# EAGLE design KitchenLightsController V2 (EAGLE 7.4.0)
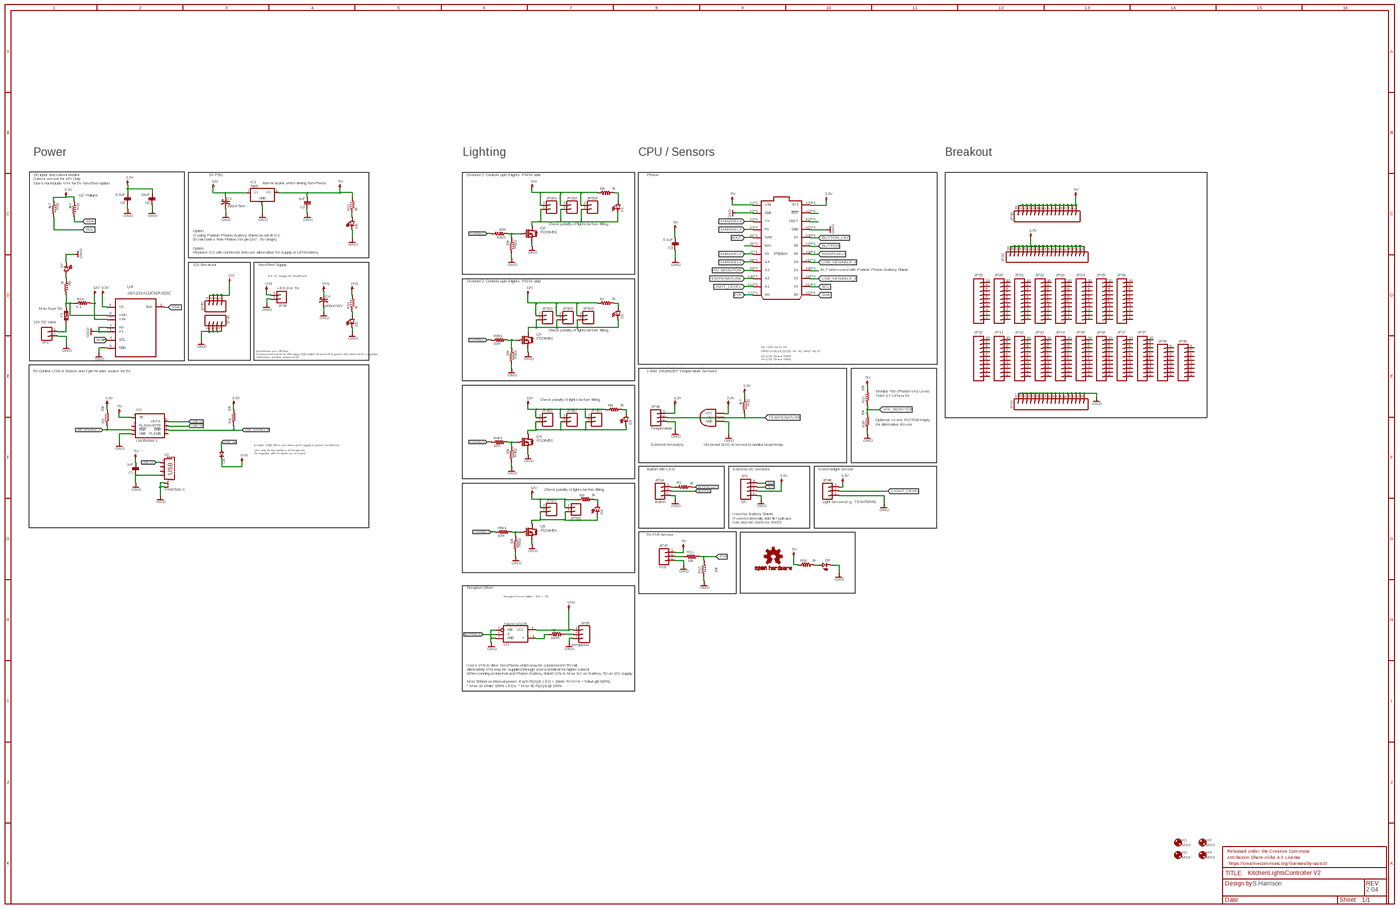
[diagram p0: schematic, sheet 1, overview]
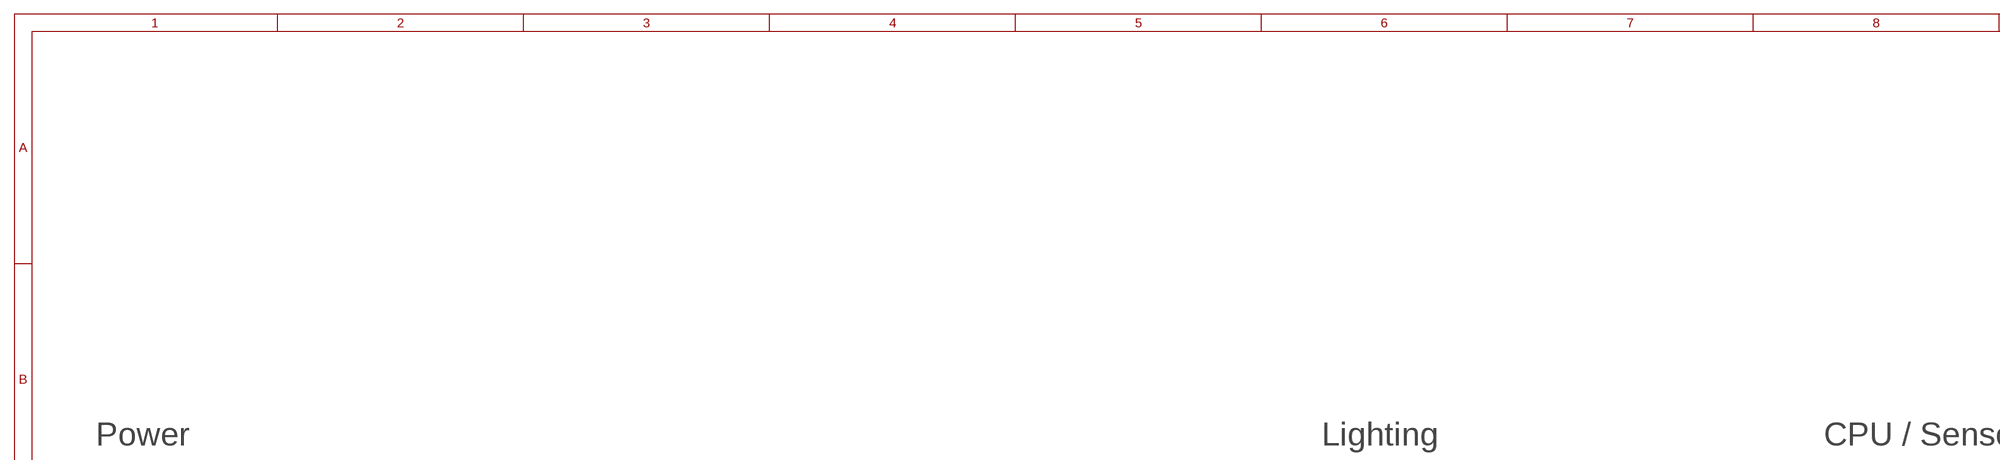
[diagram p1: schematic, sheet 1, part 1 of 4]
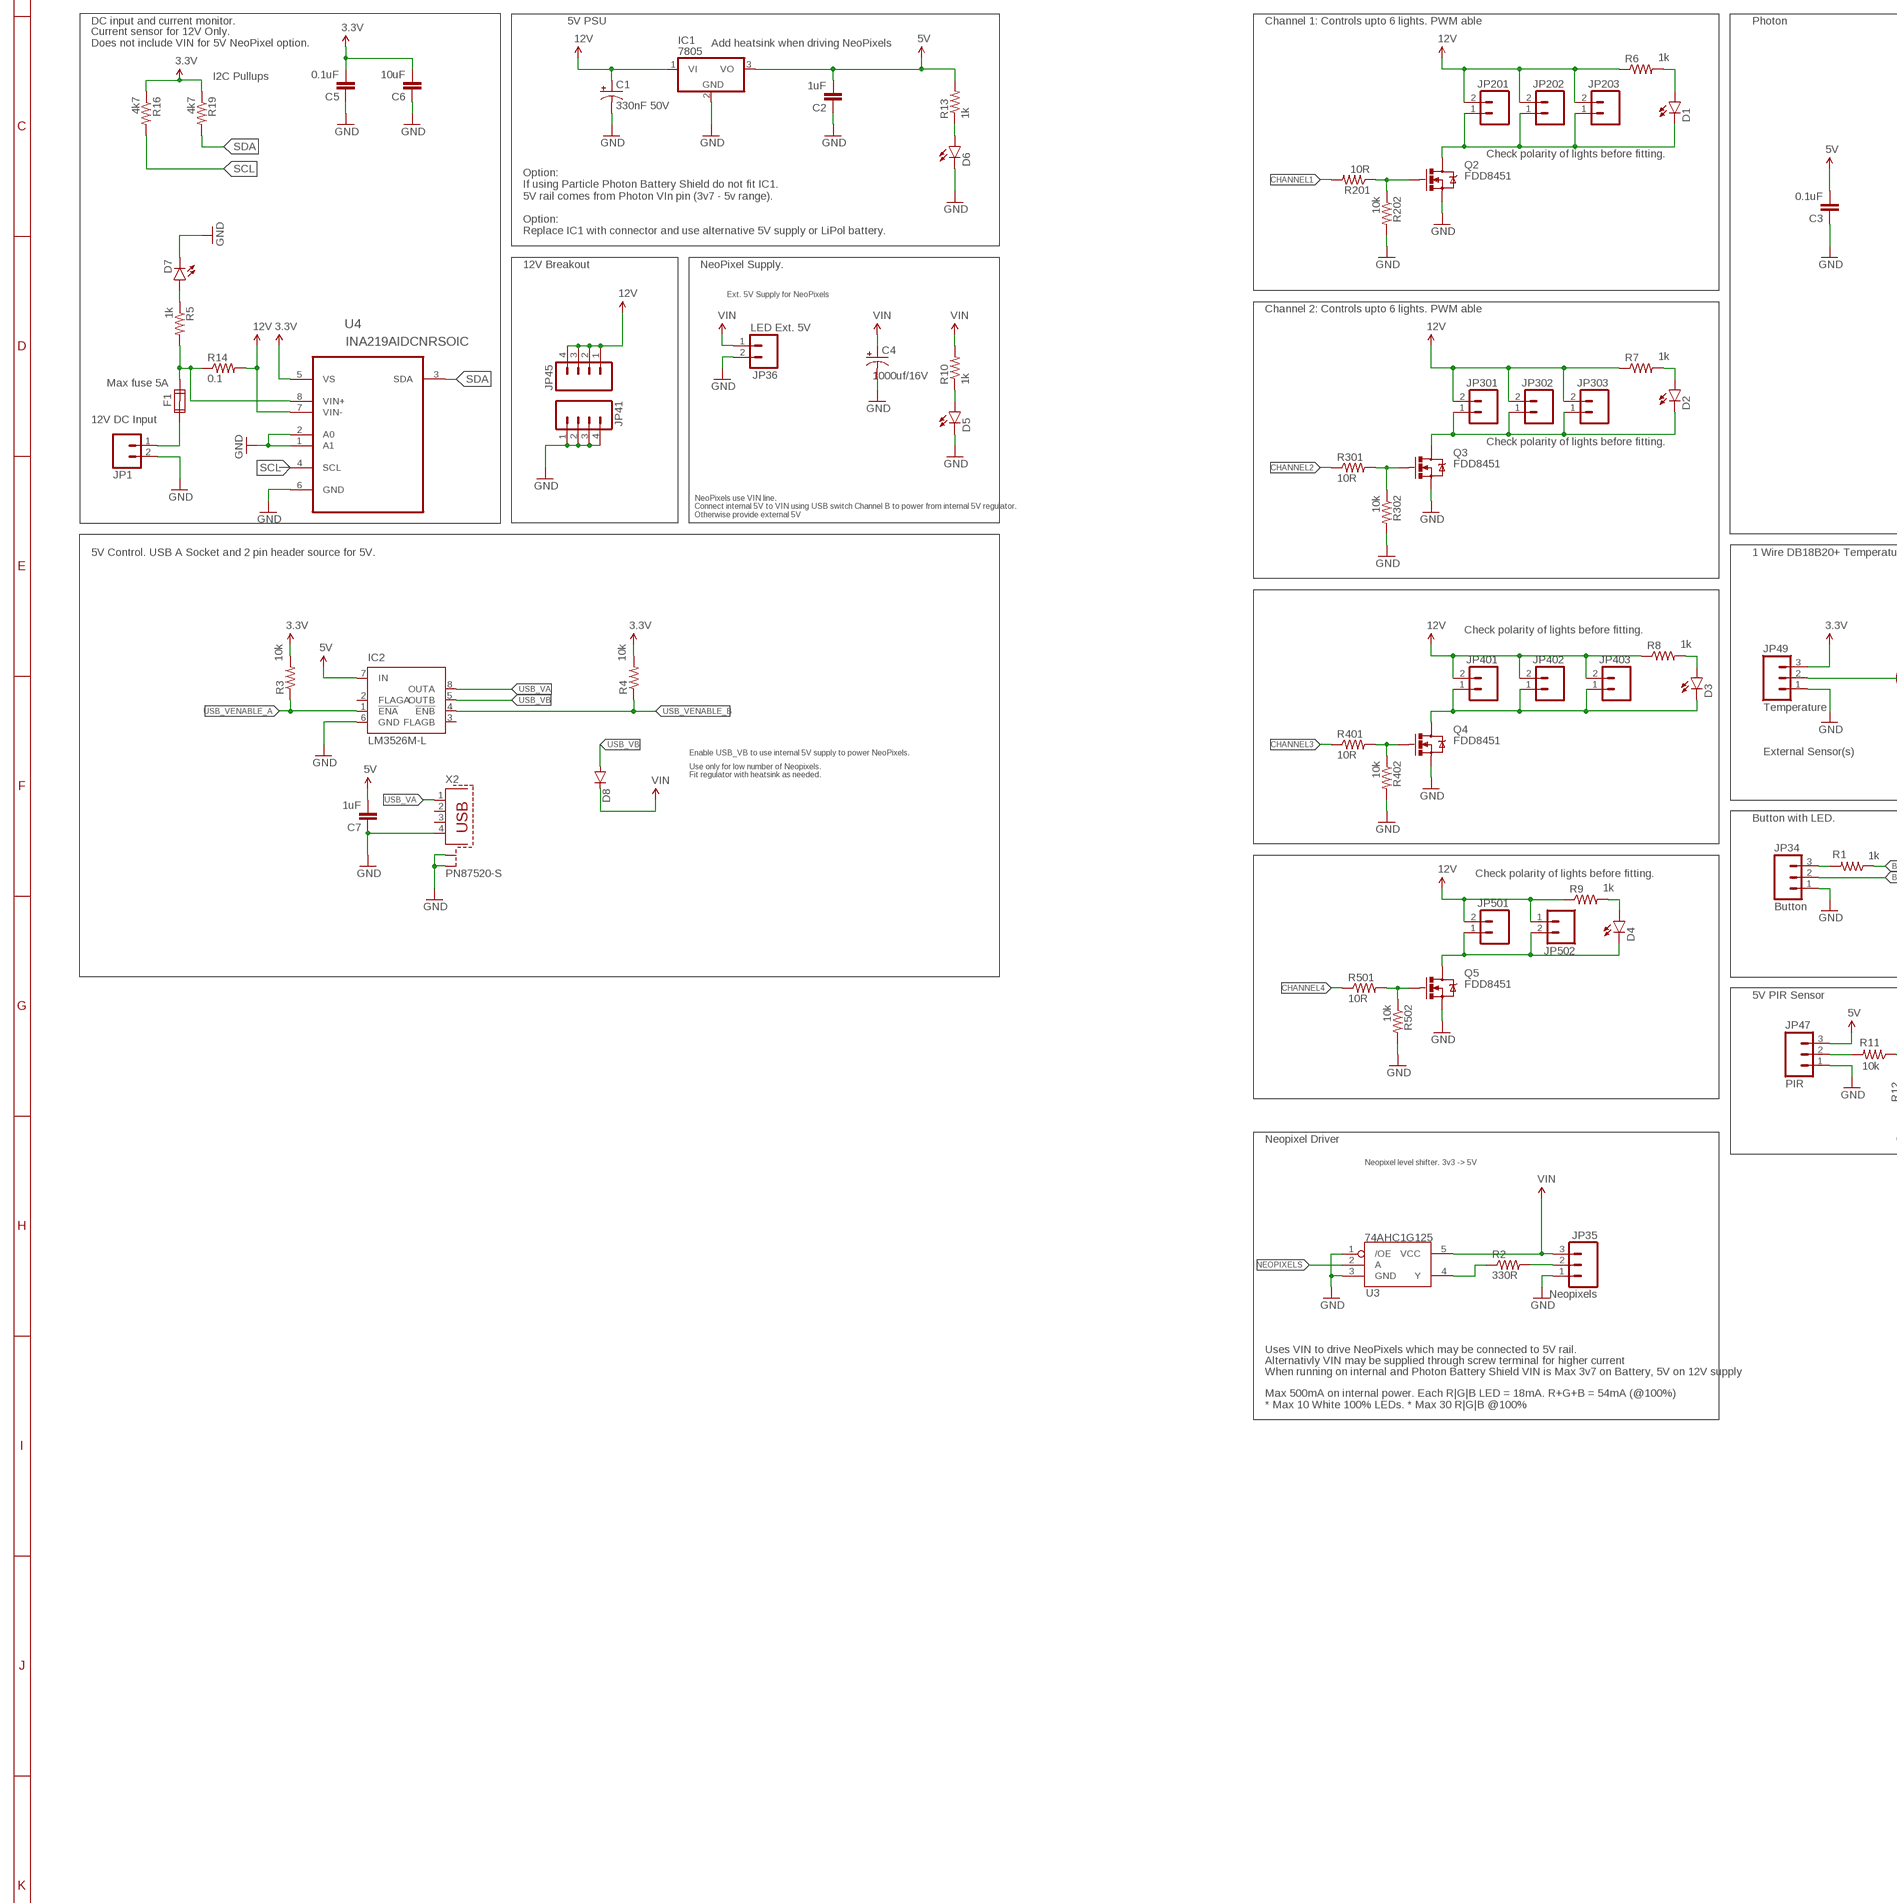
[diagram p2: schematic, sheet 1, part 2 of 4]
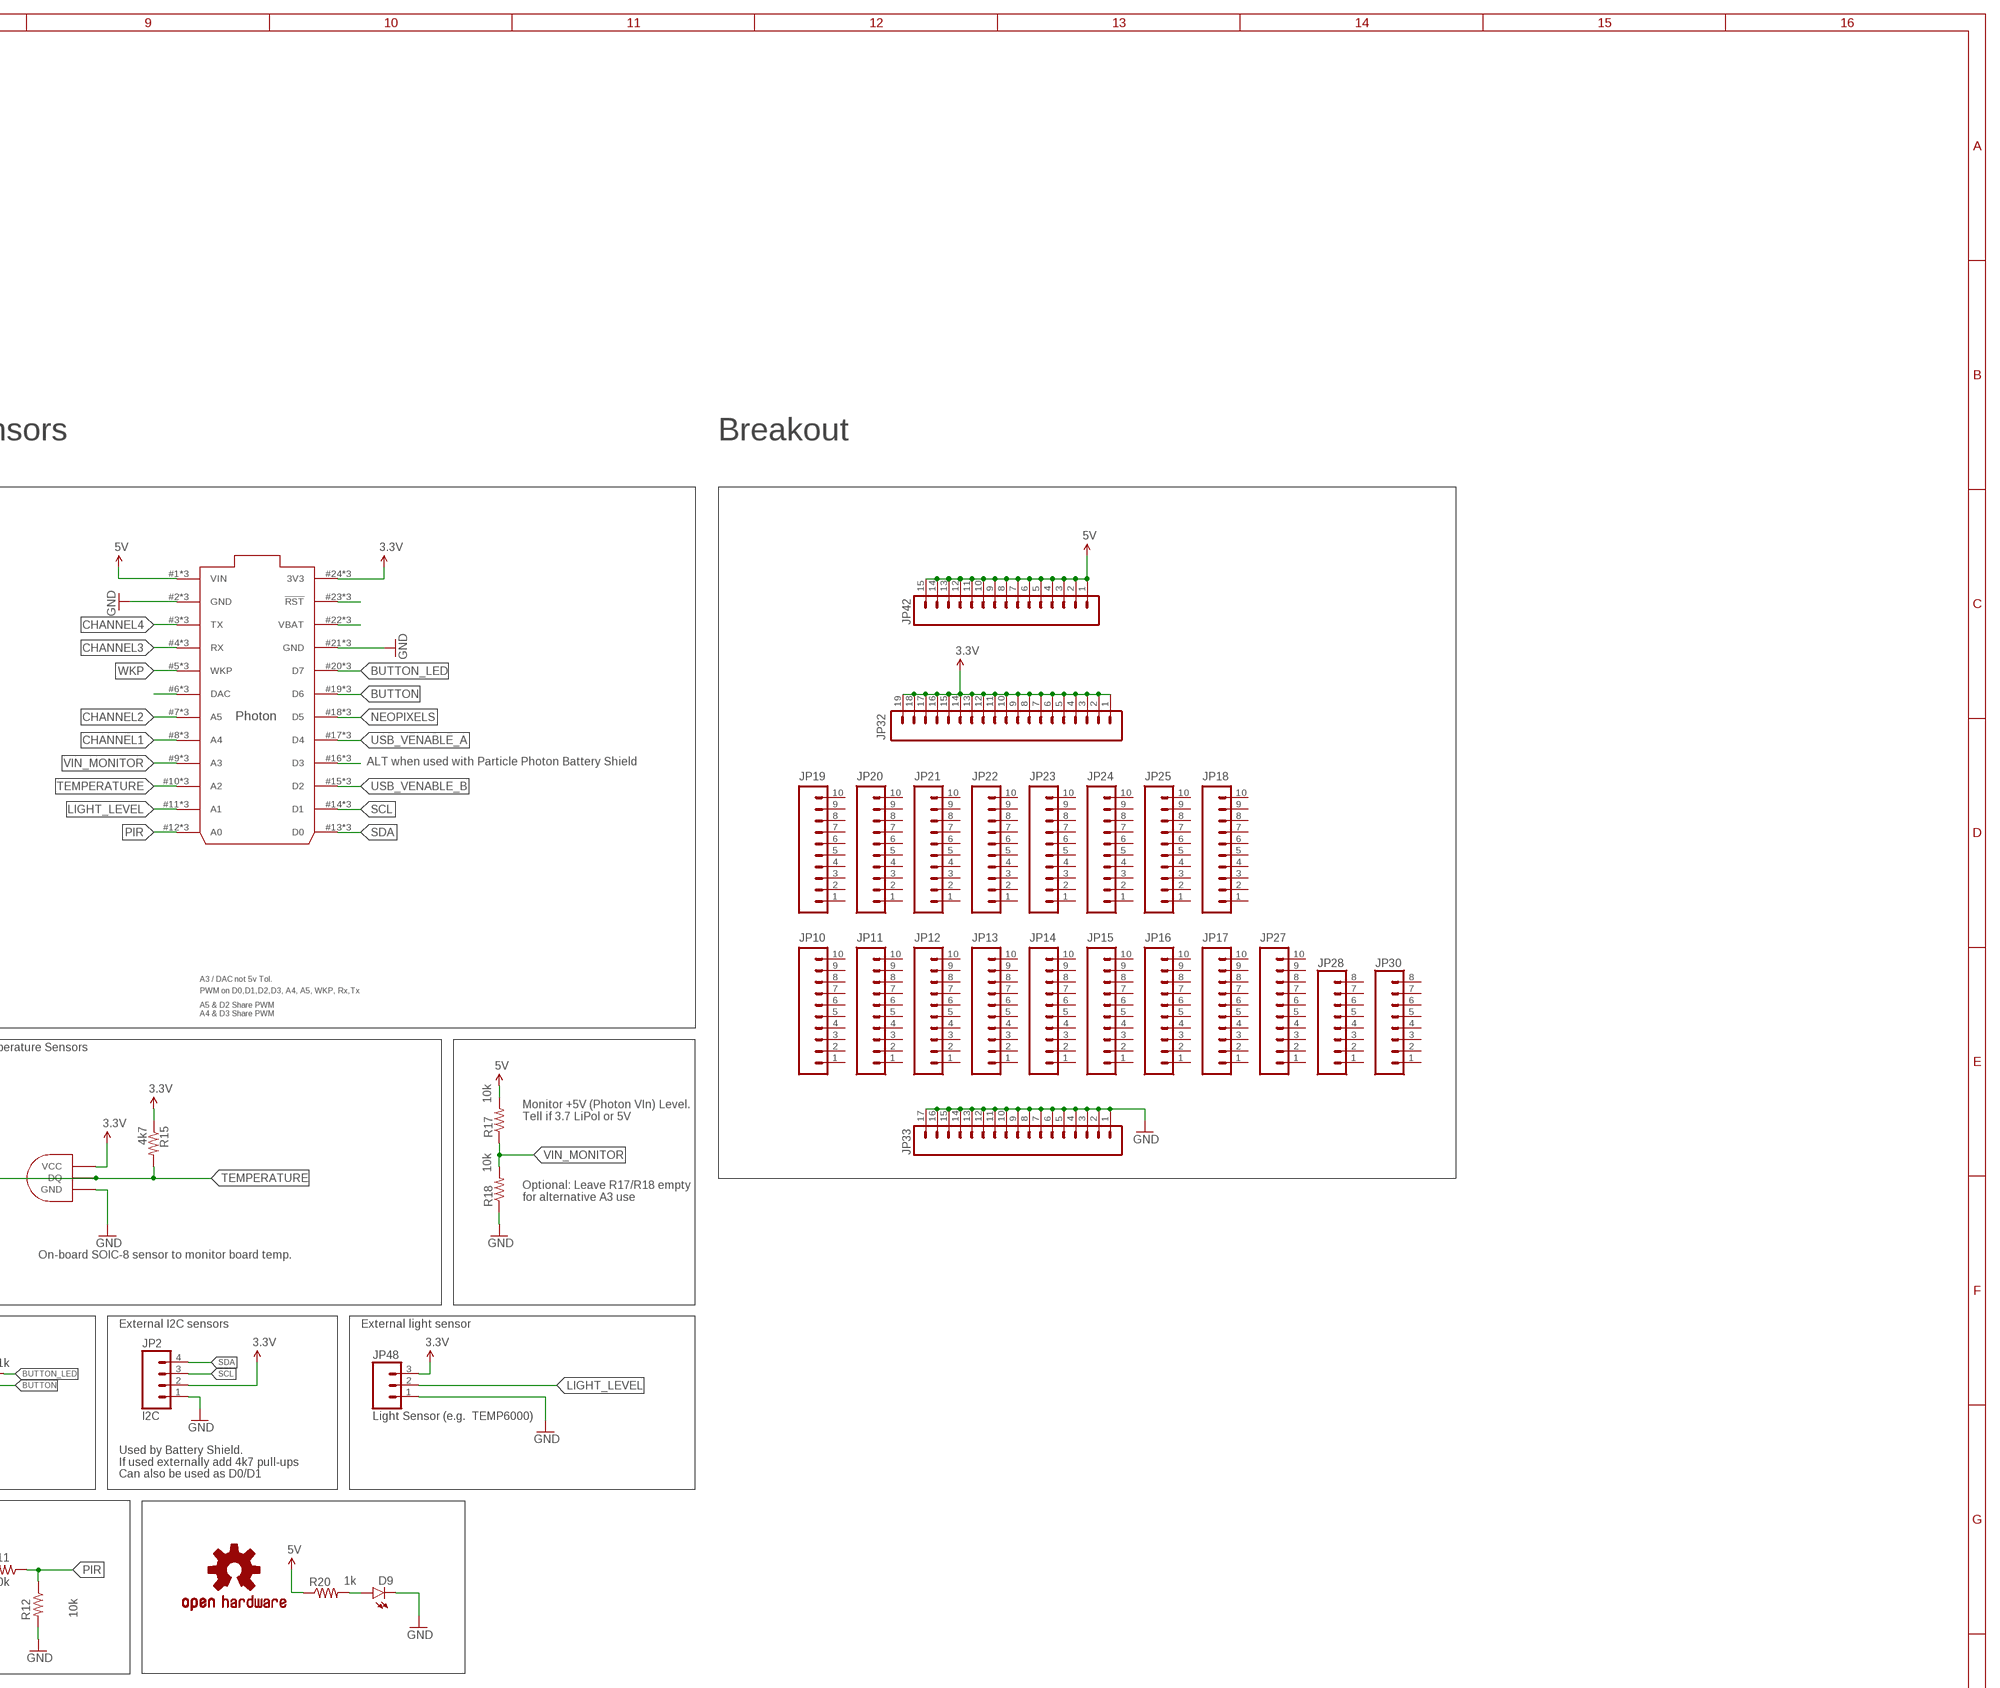
[diagram p3: schematic, sheet 1, part 3 of 4]
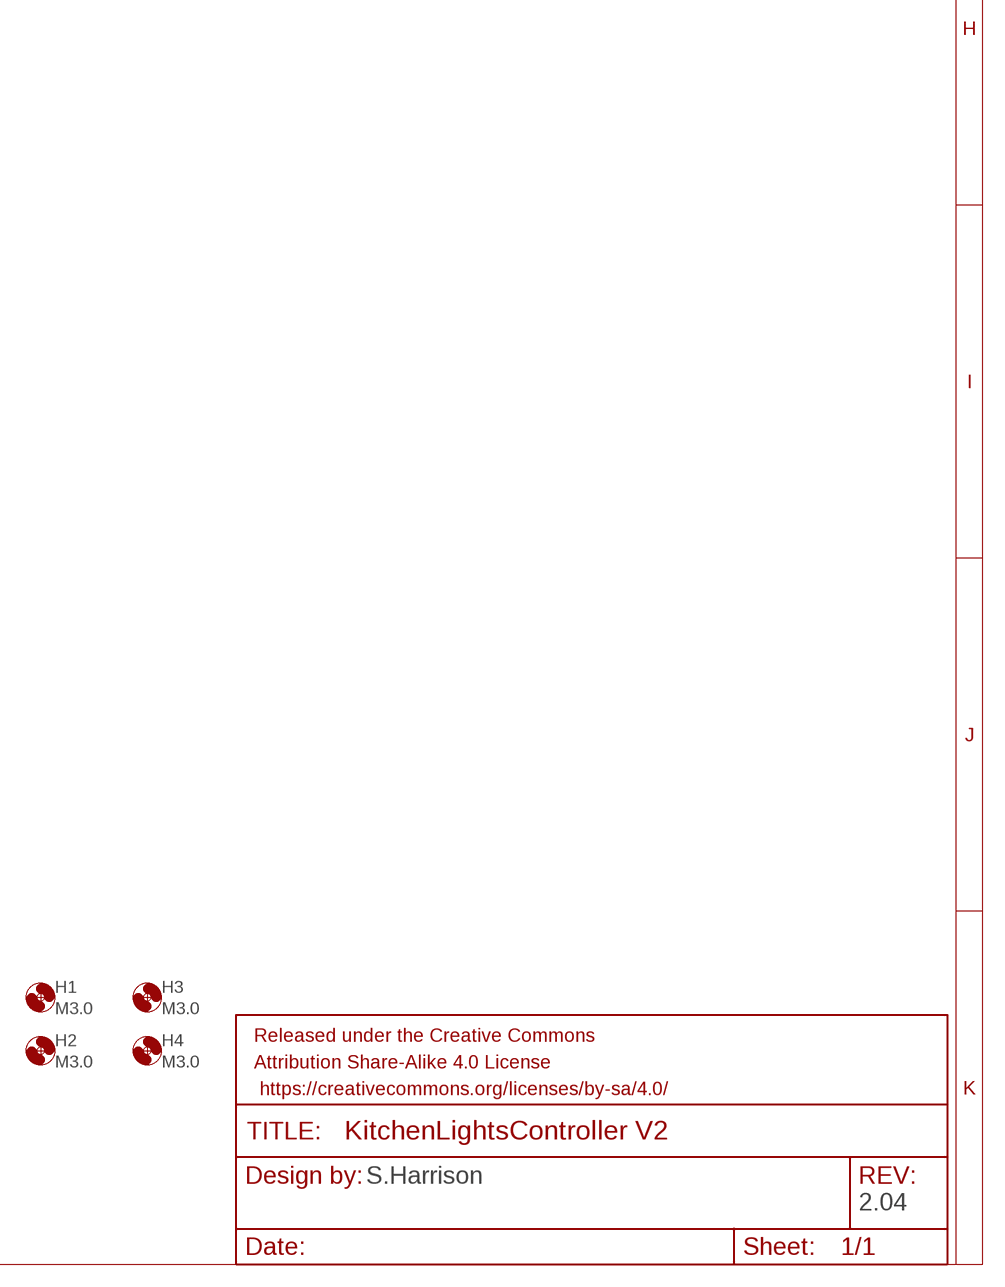
[diagram p4: schematic, sheet 1, part 4 of 4]

## Parts
C1  330nF 50V  10UF-25V-20%(PTH)  [CPOL-RADIAL-10UF-25V]
C2  1uF  1UF-25V-10%(0805)"  [0805-CAP]
C3  0.1uF  1UF-25V-10%(0805)"  [0805-CAP]
C4  1000uf/16V  1000UF-25V(PTH)KIT  [CPOL-RADIAL-1000UF-25V-KIT]
C5  0.1uF  1UF-25V-10%(0805)"  [0805-CAP]
C6  10uF  1UF-25V-10%(0805)"  [0805-CAP]
C7  1uF  1UF-25V-10%(0805)"  [0805-CAP]
D1  GREEN  LED-GREEN1206  [LED-1206]
D2  GREEN  LED-GREEN1206  [LED-1206]
D3  GREEN  LED-GREEN1206  [LED-1206]
D4  GREEN  LED-GREEN1206  [LED-1206]
D5  GREEN  LED-GREEN1206  [LED-1206]
D6  GREEN  LED-GREEN1206  [LED-1206]
D7  GREEN  LED-GREEN1206  [LED-1206]
D8  DIODESMA-KIT  [SMA-DIODE-KIT]
D9  LED1206-BOTTOM  [LED-1206-BOTTOM]
F1  FUSE2P  [FUSE1]
FRAME1  FRAME-LETTER  [CREATIVE_COMMONS]
H1  M3.0  MOUNT-HOLE3.0  [3,0]
H2  M3.0  MOUNT-HOLE3.0  [3,0]
H3  M3.0  MOUNT-HOLE3.0  [3,0]
H4  M3.0  MOUNT-HOLE3.0  [3,0]
IC1  7805  788TV  [TO220V]
IC2  LM3526M-L  [SO08]
JP1  M025MM  [SCREWTERMINAL-5MM-2]
JP2  I2C  M04PTH  [1X04]
JP10  M10NO_SILK_PTH_FEMALE  [1X10_NO_SILK]
JP11  M10NO_SILK_PTH_FEMALE  [1X10_NO_SILK]
JP12  M10NO_SILK_PTH_FEMALE  [1X10_NO_SILK]
JP13  M10NO_SILK_PTH_FEMALE  [1X10_NO_SILK]
JP14  M10NO_SILK_PTH_FEMALE  [1X10_NO_SILK]
JP15  M10NO_SILK_PTH_FEMALE  [1X10_NO_SILK]
JP16  M10NO_SILK_PTH_FEMALE  [1X10_NO_SILK]
JP17  M10NO_SILK_PTH_FEMALE  [1X10_NO_SILK]
JP18  M10NO_SILK_PTH_FEMALE  [1X10_NO_SILK]
JP19  M10NO_SILK_PTH_FEMALE  [1X10_NO_SILK]
JP20  M10NO_SILK_PTH_FEMALE  [1X10_NO_SILK]
JP21  M10NO_SILK_PTH_FEMALE  [1X10_NO_SILK]
JP22  M10NO_SILK_PTH_FEMALE  [1X10_NO_SILK]
JP23  M10NO_SILK_PTH_FEMALE  [1X10_NO_SILK]
JP24  M10NO_SILK_PTH_FEMALE  [1X10_NO_SILK]
JP25  M10NO_SILK_PTH_FEMALE  [1X10_NO_SILK]
JP27  M10NO_SILK_PTH_FEMALE  [1X10_NO_SILK]
JP28  M08NO_SILK_FEMALE_PTH  [1X08_NO_SILK]
JP30  M08NO_SILK_FEMALE_PTH  [1X08_NO_SILK]
JP32  M191X19  [1X19]
JP33  M17  [1X17]
JP34  Button  M03POLAR  [MOLEX-1X3]
JP35  Neopixels  M03POLAR  [MOLEX-1X3]
JP36  LED Ext. 5V  M023.5MM  [SCREWTERMINAL-3.5MM-2]
JP41  M04PTH  [1X04]
JP42  M15  [1X15]
JP45  M04PTH  [1X04]
JP47  PIR  M03POLAR  [MOLEX-1X3]
JP48  Light Sensor (e.g. TEMP6000)  M03POLAR  [MOLEX-1X3]
JP49  Temperature  M03POLAR  [MOLEX-1X3]
JP201  M02POLAR  [MOLEX-1X2]
JP202  M02POLAR  [MOLEX-1X2]
JP203  M02POLAR  [MOLEX-1X2]
JP301  M02POLAR  [MOLEX-1X2]
JP302  M02POLAR  [MOLEX-1X2]
JP303  M02POLAR  [MOLEX-1X2]
JP401  M02POLAR  [MOLEX-1X2]
JP402  M02POLAR  [MOLEX-1X2]
JP403  M02POLAR  [MOLEX-1X2]
JP501  M02POLAR  [MOLEX-1X2]
JP502  M023.5MM  [SCREWTERMINAL-3.5MM-2]
LOGO1  OSHW-LOGOM  [OSHW-LOGO-M]
Q2  FDD8451  MOSFET-NCHANNELFDD8780  [DPAK]
Q3  FDD8451  MOSFET-NCHANNELFDD8780  [DPAK]
Q4  FDD8451  MOSFET-NCHANNELFDD8780  [DPAK]
Q5  FDD8451  MOSFET-NCHANNELFDD8780  [DPAK]
R1  1k  RESISTOR0805-RES  [0805]
R2  330R  RESISTOR0805-RES  [0805]
R3  10k  RESISTOR0805-RES  [0805]
R4  10k  RESISTOR0805-RES  [0805]
R5  1k  RESISTOR0805-RES  [0805]
R6  1k  RESISTOR0805-RES  [0805]
R7  1k  RESISTOR0805-RES  [0805]
R8  1k  RESISTOR0805-RES  [0805]
R9  1k  RESISTOR0805-RES  [0805]
R10  1k  RESISTOR0805-RES  [0805]
R11  10k  RESISTOR0805-RES  [0805]
R12  10k  RESISTOR0805-RES  [0805]
R13  1k  RESISTOR0805-RES  [0805]
R14  0.1  0.001OHM-3W-1%(2512)3W/1%  [2512]
R15  4k7  RESISTOR0805-RES  [0805]
R16  4k7  RESISTOR0805-RES  [0805]
R17  10k  RESISTOR0805-RES  [0805]
R18  10k  RESISTOR0805-RES  [0805]
R19  4k7  RESISTOR0805-RES  [0805]
R20  1k  RESISTOR0805-RES  [0805]
R201  10R  RESISTOR0805-RES  [0805]
R202  10k  RESISTOR0805-RES  [0805]
R301  10R  RESISTOR0805-RES  [0805]
R302  10k  RESISTOR0805-RES  [0805]
R401  10R  RESISTOR0805-RES  [0805]
R402  10k  RESISTOR0805-RES  [0805]
R501  10R  RESISTOR0805-RES  [0805]
R502  10k  RESISTOR0805-RES  [0805]
U1  PHOTON_WITH_STACKABLE_HEADERS  [PHOTON_STACKABLE]
U2  DS1820SOIC  [DS18B20_SOIC]
U3  74AHC1G125  [SOT23-5]
U4  INA219AIDCNRSOIC  [SO08]
X2  PN87520-S  [PN87520-S]

## Nets
3.3V: C5.2 C6.2 JP2.2 JP32.1 JP32.2 JP32.3 JP32.4 JP32.5 JP32.6 JP32.7 JP32.8 JP32.9 JP32.10 JP32.11 JP32.12 JP32.13 JP32.14 JP32.15 JP32.16 JP32.17 JP32.18 JP32.19 JP48.3 JP49.3 R3.2 R4.2 R15.1 R16.1 R19.1 U1.24(3V3) U1.#24(3V3) U1.@24(3V3) U2.VCC U4.5(VS)
5V: C2.2 C3.2 C7.2 IC1.3(VO) IC2.7(IN) JP42.1 JP42.2 JP42.3 JP42.4 JP42.5 JP42.6 JP42.7 JP42.8 JP42.9 JP42.10 JP42.11 JP42.12 JP42.13 JP42.14 JP42.15 JP47.3 R13.2 R17.2 R20.1 U1.1(VIN) U1.#1(VIN) U1.@1(VIN)
12V: C1.1(+) IC1.1(VI) JP45.1 JP45.2 JP45.3 JP45.4 JP201.2 JP202.2 JP203.2 JP301.2 JP302.2 JP303.2 JP401.2 JP402.2 JP403.2 JP501.2 JP502.1 R6.1 R7.1 R8.1 R9.1 R14.2 U4.7(VIN-)
BUTTON: JP34.2 U1.19(D6) U1.#19(D6) U1.@19(D6)
BUTTON_LED: R1.1 U1.20(D7) U1.#20(D7) U1.@20(D7)
CHANNEL1: R201.2 U1.8(A4) U1.#8(A4) U1.@8(A4)
CHANNEL2: R301.1 U1.7(A5) U1.#7(A5) U1.@7(A5)
CHANNEL3: R401.1 U1.4(RX) U1.#4(RX) U1.@4(RX)
CHANNEL4: R501.1 U1.3(TX) U1.#3(TX) U1.@3(TX)
CHANNEL_1_SWITCHED: D1.C JP201.1 JP202.1 JP203.1 Q2.4(D)
CHANNEL_2_SWITCHED: D2.C JP301.1 JP302.1 JP303.1 Q3.4(D)
CHANNEL_3_SWITCHED: D3.C JP401.1 JP402.1 JP403.1 Q4.4(D)
CHANNEL_4_SWITCHED: D4.C JP501.1 JP502.2 Q5.4(D)
D3: U1.16(D3) U1.#16(D3) U1.@16(D3)
DAC: U1.6(DAC) U1.#6(DAC) U1.@6(DAC)
GND: C1.2(-) C2.1 C3.1 C4.- C5.1 C6.1 C7.1 D5.C D6.C D7.C D9.C IC1.2(GND) IC2.6(GND) JP1.2 JP2.1 JP33.1 JP33.2 JP33.3 JP33.4 JP33.5 JP33.6 JP33.7 JP33.8 JP33.9 JP33.10 JP33.11 JP33.12 JP33.13 JP33.14 JP33.15 JP33.16 JP33.17 JP34.1 JP35.1 JP36.2 JP41.1 JP41.2 JP41.3 JP41.4 JP47.1 JP48.1 JP49.1 Q2.3(S) Q3.3(S) Q4.3(S) Q5.3(S) R12.2 R18.1 R202.2 R302.2 R402.2 R502.2 U1.2(GND) U1.21(GND) U1.#2(GND) U1.#21(GND) U1.@2(GND) U1.@21(GND) U2.GND U3.1(/OE) U3.3(GND) U4.1(A1) U4.2(A0) U4.6(GND) X2.4 X2.S1 X2.S2
LIGHT_LEVEL: JP48.2 U1.11(A1) U1.#11(A1) U1.@11(A1)
N$1: D7.A R5.1
N$2: Q2.1(G) R201.1 R202.1
N$3: Q3.1(G) R301.2 R302.1
N$4: Q4.1(G) R401.2 R402.1
N$5: F1.2A R5.2 R14.1 U4.8(VIN+)
N$6: R2.1 U3.4(Y)
N$7: Q5.1(G) R501.2 R502.1
N$8: JP35.2 R2.2
N$9: D9.A R20.2
N$11: F1.1A JP1.1
N$12: JP34.3 R1.2
N$22: D6.A R13.1
N$23: D5.A R10.1
N$24: D4.A R9.2
N$25: D3.A R8.2
N$26: JP47.2 R11.2
N$27: D2.A R7.2
N$32: D1.A R6.2
NEOPIXELS: U1.18(D5) U1.#18(D5) U1.@18(D5) U3.2(A)
PIR: R11.1 R12.1 U1.12(A0) U1.#12(A0) U1.@12(A0)
RST: U1.23(!RST) U1.#23(!RST) U1.@23(!RST)
SCL: JP2.3 R16.2 U1.14(D1) U1.#14(D1) U1.@14(D1) U4.4(SCL)
SDA: JP2.4 R19.2 U1.13(D0) U1.#13(D0) U1.@13(D0) U4.3(SDA)
TEMPERATURE: JP49.2 R15.2 U1.10(A2) U1.#10(A2) U1.@10(A2) U2.DQ
USB_VA: IC2.8(OUTA) X2.1
USB_VB: D8.A IC2.5(OUTB)
USB_VENABLE_A: IC2.1(!ENA) R3.1 U1.17(D4) U1.#17(D4) U1.@17(D4)
USB_VENABLE_B: IC2.4(!ENB) R4.1 U1.15(D2) U1.#15(D2) U1.@15(D2)
VBAT: U1.22(VBAT) U1.#22(VBAT) U1.@22(VBAT)
VIN: C4.+ D8.C JP35.3 JP36.1 R10.2 U3.5(VCC)
VIN_MONITOR: R17.1 R18.2 U1.9(A3) U1.#9(A3) U1.@9(A3)
WKP: U1.5(WKP) U1.#5(WKP) U1.@5(WKP)
Unconnected: F1.1B F1.2B IC2.2(FLAGA) IC2.3(FLAGB) JP10.1 JP10.2 JP10.3 JP10.4 JP10.5 JP10.6 JP10.7 JP10.8 JP10.9 JP10.10 JP11.1 JP11.2 JP11.3 JP11.4 JP11.5 JP11.6 JP11.7 JP11.8 JP11.9 JP11.10 JP12.1 JP12.2 JP12.3 JP12.4 JP12.5 JP12.6 JP12.7 JP12.8 JP12.9 JP12.10 JP13.1 JP13.2 JP13.3 JP13.4 JP13.5 JP13.6 JP13.7 JP13.8 JP13.9 JP13.10 JP14.1 JP14.2 JP14.3 JP14.4 JP14.5 JP14.6 JP14.7 JP14.8 JP14.9 JP14.10 JP15.1 JP15.2 JP15.3 JP15.4 JP15.5 JP15.6 JP15.7 JP15.8 JP15.9 JP15.10 JP16.1 JP16.2 JP16.3 JP16.4 JP16.5 JP16.6 JP16.7 JP16.8 JP16.9 JP16.10 JP17.1 JP17.2 JP17.3 JP17.4 JP17.5 JP17.6 JP17.7 JP17.8 JP17.9 JP17.10 JP18.1 JP18.2 JP18.3 JP18.4 JP18.5 JP18.6 JP18.7 JP18.8 JP18.9 JP18.10 JP19.1 JP19.2 JP19.3 JP19.4 JP19.5 JP19.6 JP19.7 JP19.8 JP19.9 JP19.10 JP20.1 JP20.2 JP20.3 JP20.4 JP20.5 JP20.6 JP20.7 JP20.8 JP20.9 JP20.10 JP21.1 JP21.2 JP21.3 JP21.4 JP21.5 JP21.6 JP21.7 JP21.8 JP21.9 JP21.10 JP22.1 JP22.2 JP22.3 JP22.4 JP22.5 JP22.6 JP22.7 JP22.8 JP22.9 JP22.10 JP23.1 JP23.2 JP23.3 JP23.4 JP23.5 JP23.6 JP23.7 JP23.8 JP23.9 JP23.10 JP24.1 JP24.2 JP24.3 JP24.4 JP24.5 JP24.6 JP24.7 JP24.8 JP24.9 JP24.10 JP25.1 JP25.2 JP25.3 JP25.4 JP25.5 JP25.6 JP25.7 JP25.8 JP25.9 JP25.10 JP27.1 JP27.2 JP27.3 JP27.4 JP27.5 JP27.6 JP27.7 JP27.8 JP27.9 JP27.10 JP28.1 JP28.2 JP28.3 JP28.4 JP28.5 JP28.6 JP28.7 JP28.8 JP30.1 JP30.2 JP30.3 JP30.4 JP30.5 JP30.6 JP30.7 JP30.8 X2.2 X2.3

## Notes on the sheet
- Power | Lighting | CPU / Sensors | Breakout
- DC input and current monitor. | 5V PSU | Channel 1: Controls upto 6 lights. PWM able | Photon
- Current sensor for 12V Only.
  Does not include VIN for 5V NeoPixel option.
- Add heatsink when driving NeoPixels
- I2C Pullups
- Check polarity of lights before fitting.
- Option:
  If using Particle Photon Battery Shield do not fit IC1. 
  5V rail comes from Photon VIn pin (3v7 - 5v range).
  
  Option:
  Replace IC1 with connector and use alternative 5V supply or LiPol battery.
- 12V Breakout | NeoPixel Supply.
- ALT when used with Particle Photon Battery Shield
- Ext. 5V Supply for NeoPixels
- Channel 2: Controls upto 6 lights. PWM able
- Max fuse 5A
- 12V DC Input
- Check polarity of lights before fitting.
- A3 / DAC not 5v Tol.
- PWM on D0,D1,D2,D3, A4, A5, WKP, Rx,Tx
- NeoPixels use VIN line. 
  Connect internal 5V to VIN using USB switch Channel B to power from internal 5V regulator. 
  Otherwise provide external 5V
- A5 & D2 Share PWM
  A4 & D3 Share PWM
- 5V Control. USB A Socket and 2 pin header source for 5V. | 1 Wire DB18B20+ Temperature Sensors
- Monitor +5V (Photon VIn) Level.
  Tell if 3.7 LiPol or 5V
- Check polarity of lights before fitting.
- Optional: Leave R17/R18 empty
  for alternative A3 use
- Enable USB_VB to use internal 5V supply to power NeoPixels. | External Sensor(s) | On-board SOIC-8 sensor to monitor board temp.
- Use only for low number of Neopixels. 
  Fit regulator with heatsink as needed.
- Button with LED. | External I2C sensors | External light sensor
- Check polarity of lights before fitting.
- Used by Battery Shield.
  If used externally add 4k7 pull-ups
- Can also be used as D0/D1
- 5V PIR Sensor
- Neopixel Driver
- Neopixel level shifter. 3v3 -> 5V
- Uses VIN to drive NeoPixels which may be connected to 5V rail.
- Alternativly VIN may be supplied through screw terminal for higher current
- When running on internal and Photon Battery Shield VIN is Max 3v7 on Battery, 5V on 12V supply
- Max 500mA on internal power. Each R|G|B LED = 18mA. R+G+B = 54mA (@100%)
  * Max 10 White 100% LEDs. * Max 30 R|G|B @100%
- S.Harrison
- 2.04

## Library data of the parts
C1 = SparkFun-Capacitors:10UF-25V-20%(PTH): CAP-08440; FARNELL: 1902922; PROD_ID: CAP-08440
C2 C3 C5-C7 = SparkFun-Capacitors:1UF-25V-10%(0805): CAP-08064
C4 = SparkFun-Capacitors:1000UF-25V(PTH): CAP-08070; FARNELL: 9693610; PROD_ID: CAP-09538; VALUE: 1000uf/25V
D1-D7 = SparkFun-LED:LED-GREEN: Various green LEDs Green LEDs used in SFE Production 0603- DIO-00821 LARGE- DIO-00862 LILYPAD- DIO-09910; PROD_ID: DIO-00862
D8 = SparkFun-DiscreteSemi:DIODE: Diode These are standard reverse protection diodes and small signal diodes. SMA package can handle up to about 1A. SOD-323 can handle about 200mA. What the SOD-323 package when ordering, there are some mfgs out there that are 5-pin packages.
D9 = SparkFun-LED:LED: LEDs Standard schematic elements and footprints for 5mm, 3mm, 1206, and 0603 sized LEDs. 5mm - Spark Fun Electronics SKU : COM-00529 (and others)
F1 = special:FUSE2P: FUSE 5 x 20 mm; FARNELL: 1453528
FRAME1 = SparkFun-Aesthetics:FRAME-LETTER: Schematic Frame Standard 8.5x11 US Letter frame
H1-H4 = holes:MOUNT-HOLE: MOUNTING HOLE with drill center marker
IC1 = linear:78*: Positive VOLTAGE REGULATOR Source: http://cache.national.com/ds/LM/LM78L05.pdf http://www.fairchildsemi.com/ds/LM/LM7805.pdf
IC2 = SH-linear:LM3526M-L: Dual Port USB Power Switch and Over-Current Protection LOW active
JP1 = SparkFun-Connectors:M02: Standard 2-pin 0.1" header. Use with - straight break away headers ( PRT-00116) - right angle break away headers (PRT-00553) - swiss pins (PRT-00743) - machine pins (PRT-00117) - female headers (PRT-00115) Molex polarized connector foot print use with: PRT-08233 with associated crimp pins and housings. 2.54_SCREWTERM for use with PRT-10571. 3.5mm Screw Terminal footprints for PRT-08084 5mm Screw Terminal footprints for use with PRT-08432; FARNELL: 2008197; PLUG: 2008161; STOREFRONT_ID: PRT-08432
JP2 JP41 JP45 = SparkFun-Connectors:M04: Header 4 Standard 4-pin 0.1" header. Use with straight break away headers (SKU : PRT-00116), right angle break away headers (PRT-00553), swiss pins (PRT-00743), machine pins (PRT-00117), and female headers (PRT-00115). Molex polarized connector foot print use with SKU : PRT-08231 with associated crimp pins and housings. 1MM SMD Version SKU: PRT-10208
JP10-JP25 JP27 = SparkFun-Connectors:M10: Header 10 Standard 10-pin 0.1" header. Use with straight break away headers (SKU : PRT-00116), right angle break away headers (PRT-00553), swiss pins (PRT-00743), machine pins (PRT-00117), and female headers (PRT-00115).; PROD_ID: CONN-11563
JP28 JP30 = SparkFun-Connectors:M08: Header 8 Standard 8-pin 0.1" header. Use with straight break away headers (SKU : PRT-00116), right angle break away headers (PRT-00553), swiss pins (PRT-00743), machine pins (PRT-00117), and female headers (PRT-00115).; PROD_ID: CONN-08438
JP32 = SparkFun-Connectors:M19: 1x19 .1" header
JP33 = SparkFun-Connectors:M17: 1x17 .1" header
JP34 JP35 JP47-JP49 = SparkFun-Connectors:M03: Header 3 Standard 3-pin 0.1" header. Use with straight break away headers (SKU : PRT-00116), right angle break away headers (PRT-00553), swiss pins (PRT-00743), machine pins (PRT-00117), and female headers (PRT-00115). Molex polarized connector foot print use with SKU : PRT-08232 with associated crimp pins and housings.; FARNELL: 9731156
JP36 JP502 = SparkFun-Connectors:M02: Standard 2-pin 0.1" header. Use with - straight break away headers ( PRT-00116) - right angle break away headers (PRT-00553) - swiss pins (PRT-00743) - machine pins (PRT-00117) - female headers (PRT-00115) Molex polarized connector foot print use with: PRT-08233 with associated crimp pins and housings. 2.54_SCREWTERM for use with PRT-10571. 3.5mm Screw Terminal footprints for PRT-08084 5mm Screw Terminal footprints for use with PRT-08432; PROD_ID: CONN-08399
JP42 = SparkFun-Connectors:M15: Header 15 Standard 15-pin 0.1" header. Use with straight break away headers (SKU : PRT-00116), right angle break away headers (PRT-00553), swiss pins (PRT-00743), machine pins (PRT-00117), and female headers (PRT-00115).
JP201-JP203 JP301-JP303 JP401-JP403 JP501 = SparkFun-Connectors:M02: Standard 2-pin 0.1" header. Use with - straight break away headers ( PRT-00116) - right angle break away headers (PRT-00553) - swiss pins (PRT-00743) - machine pins (PRT-00117) - female headers (PRT-00115) Molex polarized connector foot print use with: PRT-08233 with associated crimp pins and housings. 2.54_SCREWTERM for use with PRT-10571. 3.5mm Screw Terminal footprints for PRT-08084 5mm Screw Terminal footprints for use with PRT-08432
LOGO1 = SparkFun-Aesthetics:OSHW-LOGO: Open Source Hardware Logo This logo indicates the piece of hardware it is found on incorporates a OSHW license and/or adheres to the definition of open source hardware found here: http://freedomdefined.org/OSHW
Q2-Q5 = SparkFun-DiscreteSemi:MOSFET-NCHANNEL: Common NMOSFET Parts MFG P/N Store ID Prod ID FDD8780 TRANS-09984 SI7820DN TRANS-11055 FDS6630A IC-08089 2N7002PW TRANS-11151 FQP30N06L COM-10213 TRANS-10060 BSS123LT1G TRANS-08345 BSS138 TRANS-00830 BS170 2N7000; PROD_ID: TRANS-09984
R1-R13 R15-R20 R201 R202 R301 R302 R401 R402 R501 R502 = SparkFun-Resistors:RESISTOR: Resistor Basic schematic elements and footprints for 0603, 1206, and PTH resistors.
R14 = SparkFun-Resistors:0.001OHM-3W-1%(2512); FARNELL: 1435947; PROD_ID: RES-12449; VALUE: 0.001
U1 = Particle:PHOTON
U2 = DS1820-SOIC:DS1820
U3 = SparkFun-DigitalIC:74AHC1G125: Single bus buffer gate with 3-state output; PROD_ID: IC-11920
U4 = INA219AIDCNR:INA219AIDCNR: CURRENT/POWER MONITOR
X2 = con-berg:PN87520-S; OC_FARNELL: unknown; OC_NEWARK: unknown

## Board
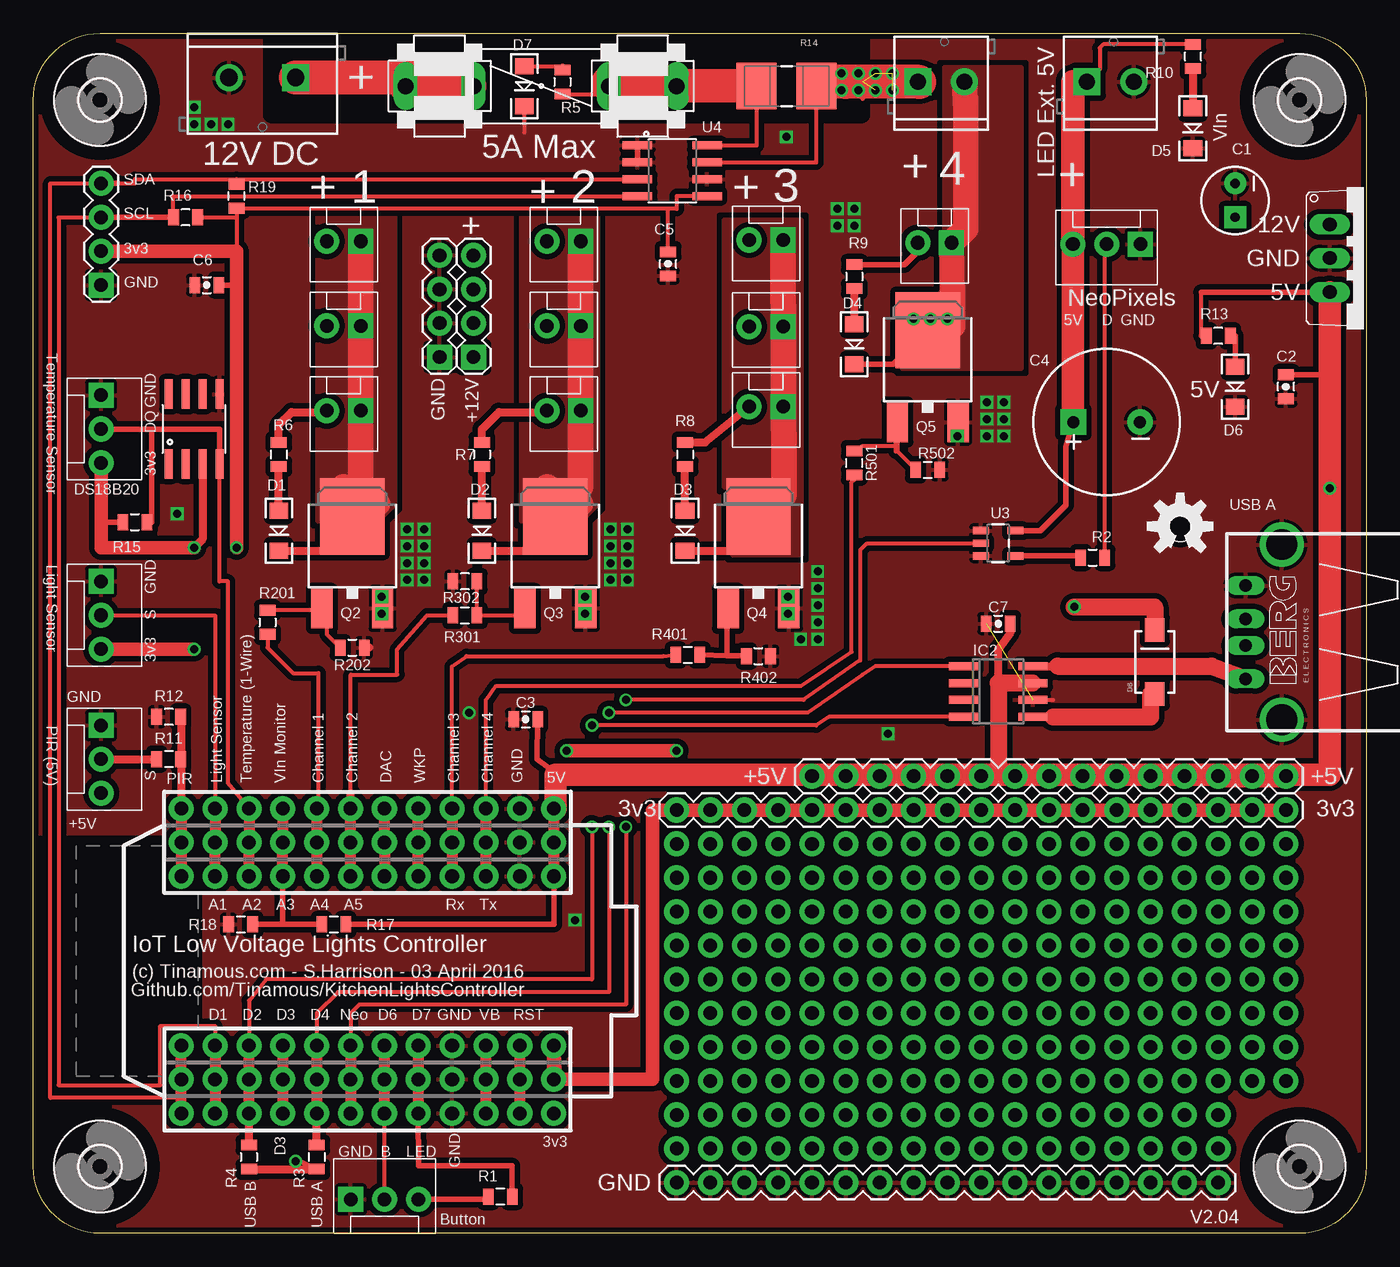
[diagram p5: board, top side]
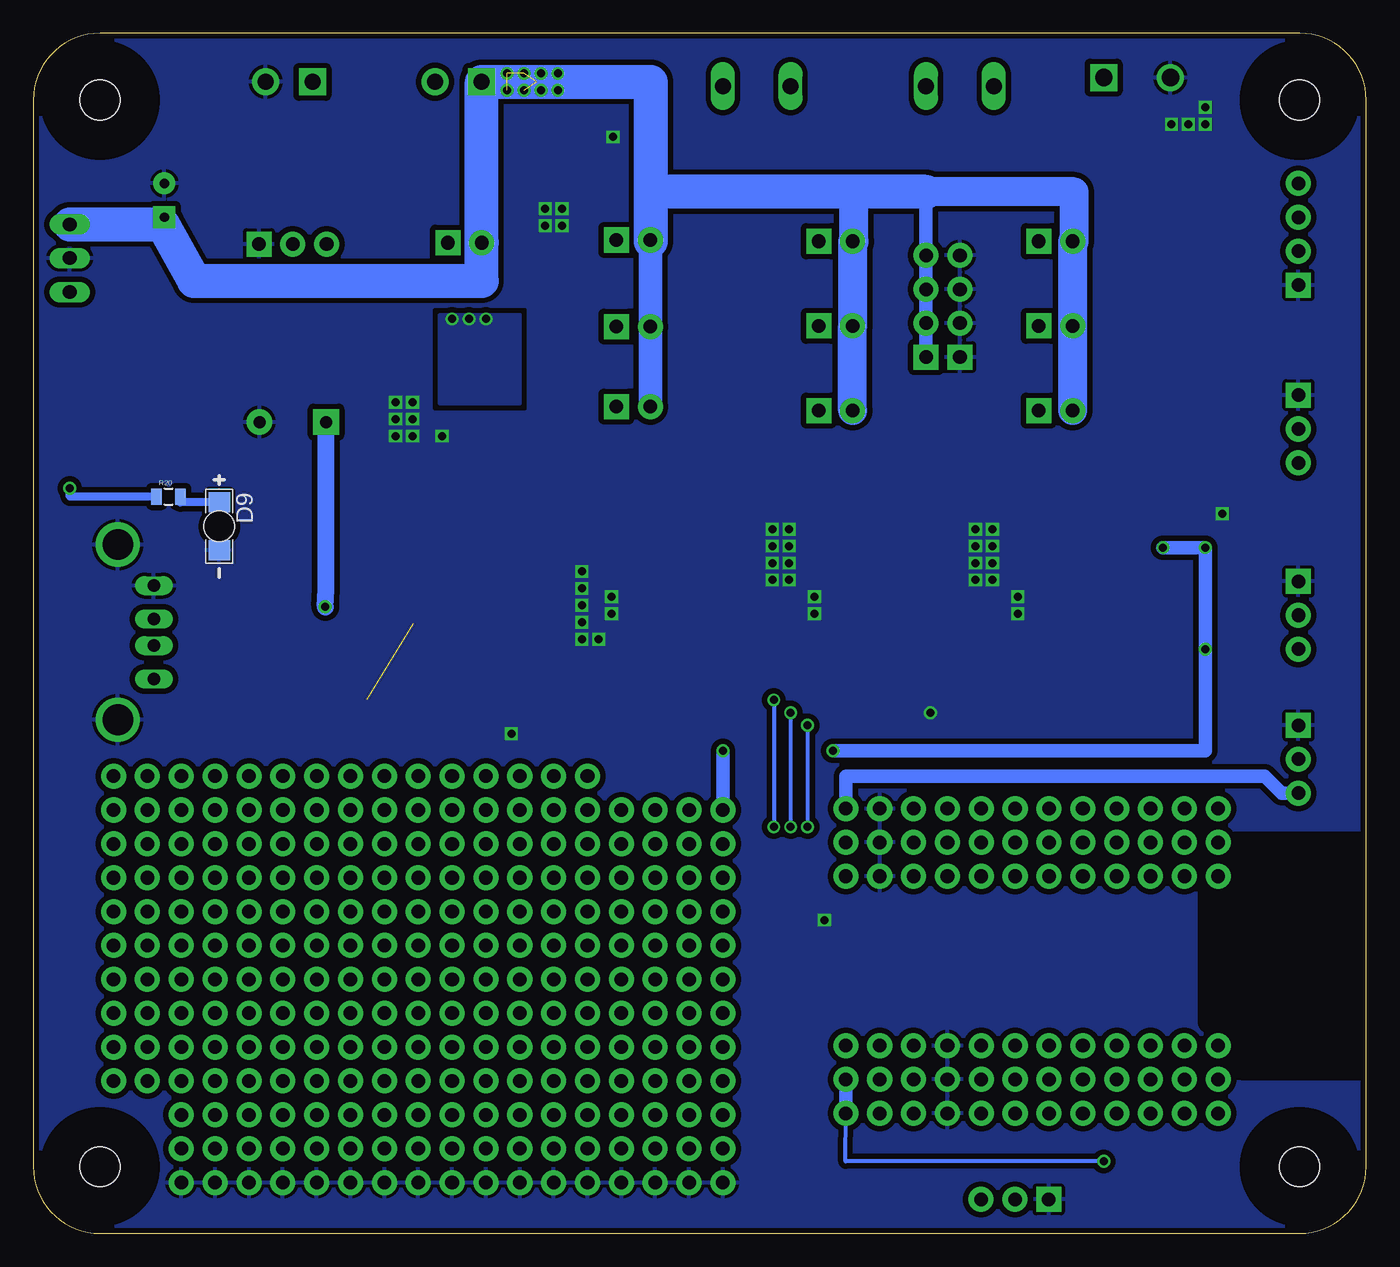
[diagram p6: board, bottom side, seen from below]

Size 100 x 90 mm. Coordinates in mm from the lower left corner, seen from the top.
Outline: 5,0 arc-90 0,5 0,85 arc-90 5,90 95,90 arc-90 100,85 100,5 arc-90 95,0 5,0
Copper layers (1*16): Top 0.0356mm / dielectric 1.5011mm / Bottom 0.0356mm
Design rules "OSHPark": minimum track width 6mil, minimum drill 13mil, track to track 6mil, track to pad 6mil, pad to pad 6mil, via to via 6mil, smd to smd 6mil, copper to edge 15mil, drill to drill 6mil, minimum pad ring 7mil, minimum via ring 7mil, stop-mask expansion 3mil, vias tented up to drill 0mil, thermal gap 10mil
tRestrict: area 0,12.1 to 12.1,29.2; area 17.8,83.8 to 62.2,90.2
bRestrict: area 0.3,12.4 to 11.7,29.2

### Footprints (pad centres in the part's own frame; a part is rotated, then mirrored left to right if it is on the bottom)
CPOL-RADIAL-10UF-25V = drill 0.7 pad 1.651 square: 1 1.27,0 | drill 0.7 pad 1.651: 2 -1.27,0
0805-CAP = smd 0.8 x 1.2: 1 -0.9,0; 2 0.9,0
CPOL-RADIAL-1000UF-25V-KIT = drill 0.9 pad 1.93 square: + 2.5,0 | drill 0.9 pad 1.93: - -2.5,0
LED-1206 = smd 1.2 x 1.4: A -1.5,0; C 1.5,0
SMA-DIODE-KIT = smd 1.77 x 1.47: A -2.4,0; C 2.4,0
LED-1206-BOTTOM = smd 1.5 x 1.6: A -1.8,0; C 1.8,0 | hole 2.3: 0,0
FUSE1 = drill 1.194 long: 1A -10.16,0; 1B -5.08,0; 2A 10.16,0; 2B 5.08,0
3,0 = hole 3: 0,0
TO220V = drill 1.016 long: 1 -2.54,-2.54; 2 0,-2.54; 3 2.54,-2.54
SO08 = smd 0.6 x 2.2: 1 -1.905,-2.6; 2 -0.635,-2.6; 3 0.635,-2.6; 4 1.905,-2.6; 5 1.905,2.6; 6 0.635,2.6; 7 -0.635,2.6; 8 -1.905,2.6
SCREWTERMINAL-5MM-2 = drill 1.3 pad 2.032 square: 1 0,0 | drill 1.3 pad 2.032: 2 5,0
1X04 = drill 1.016 pad 1.88 square: 1 0,0 | drill 1.016 pad 1.88: 2 2.54,0; 3 5.08,0; 4 7.62,0
1X10_NO_SILK = drill 1.016 pad 1.88: 1 0,0; 2 2.54,0; 3 5.08,0; 4 7.62,0; 5 10.16,0; 6 12.7,0; 7 15.24,0; 8 17.78,0; 9 20.32,0; 10 22.86,0
1X08_NO_SILK = drill 1.016 pad 1.88: 1 0,0; 2 2.54,0; 3 5.08,0; 4 7.62,0; 5 10.16,0; 6 12.7,0; 7 15.24,0; 8 17.78,0
1X19 = drill 1.016 pad 1.88: 1 0,0; 2 2.54,0; 3 5.08,0; 4 7.62,0; 5 10.16,0; 6 12.7,0; 7 15.24,0; 8 17.78,0; 9 20.32,0; 10 22.86,0; 11 25.4,0; 12 27.94,0; 13 30.48,0; 14 33.02,0; 15 35.56,0; 16 38.1,0; 17 40.64,0; 18 43.18,0; 19 45.72,0
1X17 = drill 1.016 pad 1.88: 1 0,0; 2 2.54,0; 3 5.08,0; 4 7.62,0; 5 10.16,0; 6 12.7,0; 7 15.24,0; 8 17.78,0; 9 20.32,0; 10 22.86,0; 11 25.4,0; 12 27.94,0; 13 30.48,0; 14 33.02,0; 15 35.56,0; 16 38.1,0; 17 40.64,0
MOLEX-1X3 = drill 1.016 pad 1.88 square: 1 0,0 | drill 1.016 pad 1.88: 2 2.54,0; 3 5.08,0
SCREWTERMINAL-3.5MM-2 = drill 1.2 pad 2.032 square: 1 0,0 | drill 1.2 pad 2.032: 2 3.5,0
1X15 = drill 1.016 pad 1.88: 1 0,0; 2 2.54,0; 3 5.08,0; 4 7.62,0; 5 10.16,0; 6 12.7,0; 7 15.24,0; 8 17.78,0; 9 20.32,0; 10 22.86,0; 11 25.4,0; 12 27.94,0; 13 30.48,0; 14 33.02,0; 15 35.56,0
MOLEX-1X2 = drill 1.016 pad 1.88 square: 1 0,0 | drill 1.016 pad 1.88: 2 2.54,0
DPAK = smd 1.6 x 3: 1 -2.28,-5.31; 3 2.28,-5.31 | smd 4.826 x 5.715: 4 0,1.588
0805 = smd 0.8 x 1.2: 1 -0.9,0; 2 0.9,0
2512 = smd 3 x 3.5: 1 -2.25,0; 2 2.25,0
PHOTON_STACKABLE = drill 1.016 pad 1.88: 1 1.27,32.258; 2 1.27,29.718; 3 1.27,27.178; 4 1.27,24.638; 5 1.27,22.098; 6 1.27,19.558; 7 1.27,17.018; 8 1.27,14.478; 9 1.27,11.938; 10 1.27,9.398; 11 1.27,6.858; 12 1.27,4.318; 13 19.05,4.318; 14 19.05,6.858; 15 19.05,9.398; 16 19.05,11.938; 17 19.05,14.478; 18 19.05,17.018; 19 19.05,19.558; 20 19.05,22.098; 21 19.05,24.638; 22 19.05,27.178; 23 19.05,29.718; 24 19.05,32.258; #1 3.81,32.258; #2 3.81,29.718; #3 3.81,27.178; #4 3.81,24.638; #5 3.81,22.098; #6 3.81,19.558; #7 3.81,17.018; #8 3.81,14.478; #9 3.81,11.938; #10 3.81,9.398; #11 3.81,6.858; #12 3.81,4.318; #13 21.59,4.318; #14 21.59,6.858; #15 21.59,9.398; #16 21.59,11.938; #17 21.59,14.478; #18 21.59,17.018; #19 21.59,19.558; #20 21.59,22.098; #21 21.59,24.638; #22 21.59,27.178; #23 21.59,29.718; #24 21.59,32.258; @1 -1.27,32.258; @2 -1.27,29.718; @3 -1.27,27.178; @4 -1.27,24.638; @5 -1.27,22.098; @6 -1.27,19.558; @7 -1.27,17.018; @8 -1.27,14.478; @9 -1.27,11.938; @10 -1.27,9.398; @11 -1.27,6.858; @12 -1.27,4.318; @13 16.51,4.318; @14 16.51,6.858; @15 16.51,9.398; @16 16.51,11.938; @17 16.51,14.478; @18 16.51,17.018; @19 16.51,19.558; @20 16.51,22.098; @21 16.51,24.638; @22 16.51,27.178; @23 16.51,29.718; @24 16.51,32.258
DS18B20_SOIC = smd 0.61 x 2.21: DQ 1.905,-2.616; GND 1.905,2.616; NC -1.905,-2.616; NC2 -0.635,-2.616; NC3 -1.905,2.616; NC4 -0.635,2.616; NC5 0.635,2.616; VCC 0.635,-2.616
SOT23-5 = smd 0.55 x 1.2: 1 -0.95,-1.3; 2 0,-1.3; 3 0.95,-1.3; 4 0.95,1.3; 5 -0.95,1.3
SO08' = smd 0.61 x 2.21: 1 -1.905,-2.616; 2 -0.635,-2.616; 3 0.635,-2.616; 4 1.905,-2.616; 5 1.905,2.616; 6 0.635,2.616; 7 -0.635,2.616; 8 -1.905,2.616
PN87520-S = drill 0.95 long: 1 -3.5,2.71; 2 -1,2.71; 3 1,2.71; 4 3.5,2.71 | drill 2.3 pad 2.9: S1 -6.57,0; S2 6.57,0

### Placement (x,y rotation side)
C1  90.17,77.47 270 top
C2  93.98,63.5 90 top
C3  36.94,38.55 0 top
C4  80.53,60.85 180 top
C5  47.62,72.71 90 top
C6  13.02,71.12 0 top
C7  72.39,45.72 0 top
D1  18.41,52.7 270 top
D2  33.66,52.7 270 top
D3  48.9,52.7 270 top
D4  61.59,66.67 270 top
D5  87,82.87 270 top
D6  90.17,63.5 270 top
D7  36.83,86.04 270 top
D8  84.14,42.86 90 top
D9  86.04,53.02 270 bottom
F1  38.1,86.04 0 top
FRAME1  17.95,-12.7 0 top  (outside the outline)
H1  5,5 0 top
H2  95,5 0 top
H3  95,85 0 top
H4  5,85 0 top
IC1  99.81,73.14 270 top
IC2  72.39,40.64 270 top
JP1  19.68,86.68 180 top
JP2  5.08,71.12 90 top
JP10  48.26,6.35 90 top
JP11  86.36,6.35 90 top
JP12  83.82,6.35 90 top
JP13  81.28,6.35 90 top
JP14  78.74,6.35 90 top
JP15  76.2,6.35 90 top
JP16  73.66,6.35 90 top
JP17  71.12,6.35 90 top
JP18  68.58,6.35 90 top
JP19  66.04,6.35 90 top
JP20  63.5,6.35 90 top
JP21  60.96,6.35 90 top
JP22  53.34,6.35 90 top
JP23  55.88,6.35 90 top
JP24  58.42,6.35 90 top
JP25  50.8,6.35 90 top
JP27  88.9,6.35 90 top
JP28  91.44,11.43 90 top
JP30  93.98,11.43 90 top
JP32  48.26,31.75 0 top
JP33  48.26,3.81 0 top
JP34  23.81,2.54 0 top
JP35  83.07,74.19 180 top
JP36  79.06,86.36 0 top
JP41  30.48,65.72 90 top
JP42  58.42,34.29 0 top
JP45  33.02,65.72 90 top
JP47  5.08,38.1 270 top
JP48  5.08,48.9 270 top
JP49  5.08,62.87 270 top
JP201  24.56,61.7 180 top
JP202  24.56,68.06 180 top
JP203  24.56,74.41 180 top
JP301  41.07,61.7 180 top
JP302  41.07,68.06 180 top
JP303  41.07,74.41 180 top
JP401  56.25,74.5 180 top
JP402  56.25,68 180 top
JP403  56.25,62 180 top
JP501  68.9,74.3 180 top
JP502  66.36,86.36 0 top
LOGO1  86.04,53.02 0 top
Q2  23.93,52.18 0 top
Q3  39.16,52.18 0 top
Q4  54.41,52.18 0 top
Q5  67.11,66.15 0 top
R1  35.03,2.75 180 top
R2  79.48,50.69 0 top
R3  21.27,5.71 270 top
R4  16.19,5.71 270 top
R5  39.69,86.36 270 top
R6  18.41,58.42 270 top
R7  33.66,58.42 270 top
R8  48.9,58.42 270 top
R9  61.59,71.75 270 top
R10  87,88.27 90 top
R11  10.16,35.56 180 top
R12  10.16,38.73 180 top
R13  88.9,67.31 180 top
R14  56.52,86.04 0 top
R15  7.62,53.34 0 top
R16  11.43,76.2 180 top
R17  22.54,23.18 0 top
R18  15.56,23.18 0 top
R19  15.24,77.79 90 top
R20  89.85,55.24 0 bottom
R201  17.57,45.83 270 top
R202  23.93,43.92 0 top
R301  32.38,46.35 0 top
R302  32.38,48.9 180 top
R401  49.1,43.39 0 top
R402  54.41,43.29 0 top
R501  61.59,57.78 90 top
R502  67.11,57.26 0 top
U1  6.78,30.59 270 top
U2  12.06,60.33 0 top
U3  72.39,51.75 270 top
U4  INA219AIDCNRSOIC  [SO08']  47.94,79.69 270 top
X2  93.66,45.09 90 top

### Tracks (layer width: path | path; a pad name or v marks a point on that pad's centre or on a via)
3.3V  (via drill 0.6)
  Top 0.305: U4.5 48.26,77.79 48.26,76.83 47.62,76.83 | 47.62,76.83 15.24,76.83 | 15.24,76.83 15.24,76.2 | 15.24,76.2 15.24,73.66 | C5.2 47.62,76.83 | R19.1 15.24,76.83 | R16.1 15.24,76.2
  Top 0.406: C6.2 15.24,71.12 | R15.1 5.08,53.34 | v19.68,5.4 20,5.4 R3.2
  Top 0.61: U2.VCC 12.7,52.07 v12.06,51.44 | R4.2 R3.2
  Top 1.016: JP32.19 JP32.18 JP32.17 JP32.16 JP32.15 JP32.14 JP32.13 JP32.12 JP32.11 JP32.10 JP32.9 JP32.8 JP32.7 JP32.6 JP32.5 JP32.4 JP32.3 JP32.2 JP32.1 46.47,31.75 46.47,11.54 39.8,11.54 39.16,11.67 U1.@24 U1.24 | v40.01,36.2 v48.26,36.2 | JP48.3 v12.06,43.81 | JP49.3 5.08,53.34 5.08,51.44 v12.06,51.44 | v15.24,51.44 15.24,71.12 15.24,73.66 JP2.2
  Bottom 0.305: v12.06,51.44 12.06,49.53 | U1.#24 39.05,5.4 v19.68,5.4
  Bottom 0.813: 39.16,8.87 U1.#24
  Bottom 1.016: U1.#24 U1.24 | v40.01,36.2 12.06,36.2 v12.06,43.81 v12.06,51.44 v15.24,51.44 | v48.26,36.2 JP32.1
5V  (via drill 0.6)
  Top 0.305: 87.63,67.31 87.63,70.59
  Top 0.406: C3.2 37.78,35.56 39.37,34.4 | U1.#1 39.05,26.78 39.05,23.18 R17.2 | R13.2 87.63,67.31 | C2.2 96.9,64.4 97.27,64.77 | 87.63,70.59 IC1.3
  Top 0.61: 72.39,41.27 72.39,43.81 73.34,45.09 C7.2 | v97.27,55.88 IC1.3
  Top 0.813: U1.@1 U1.1 U1.#1 | JP42.1 JP42.2 JP42.3 JP42.4 JP42.5 JP42.6 JP42.7 JP42.8 JP42.9 JP42.10 JP42.11 JP42.12 JP42.13 | 93.98,34.4 JP42.15
  Top 1.016: U1.@1 39.16,31.86 | 39.16,34.4 39.37,34.4
  Top 1.27: IC2.7 72.39,41.27 72.39,34.4
  Top 1.676: 39.16,31.86 39.16,34.4 | 39.37,34.4 72.39,34.4 93.98,34.4 97.27,34.4 v97.27,55.88 97.27,64.77 IC1.3 | JP42.13 JP42.14 JP42.15
  Bottom 0.61: R20.1 97.27,55.24 v97.27,55.88
  Bottom 1.016: JP47.3 6.35,33.02 7.62,34.29 39.04,34.29 U1.@1
12V  (via drill 0.6)  (4 unrouted)
  Top 0.305: U4.7 58.74,80.33 58.74,85.09 v60.64,85.72 60.96,86.36 | 60.96,86.36 v61.91,85.72 | 60.96,86.36 v60.64,87 | 60.96,86.36 58.42,86.36 59.69,85.09 62.23,86.36 62.23,85.09 | v61.91,87 60.96,86.36
  Top 0.406: R9.1 65.36,72.66 66.38,73.67 66.38,74.27 JP501.2
  Top 0.61: 21.59,61.27 JP201.2 21.91,61.59 19.37,61.59 18.41,60.64 R6.1 | R8.1 50.4,59.32 JP403.2 | R7.1 33.66,60.33 34.92,61.59 38.42,61.59 JP301.2
  Top 1.27: 66.47,86.36 JP502.1
  Top 2.54: 66.47,86.36 62.23,86.36 60.96,86.36 58.77,86.36 R14.2
  Bottom 0.406: C1.1 90.17,75.79 90.28,75.68 90.48,75.68 90.49,75.67
  Bottom 1.016: 33.02,78.11 JP45.4 JP45.3 JP45.2 JP45.1
  Bottom 1.27: 58.42,86.36 v60.64,87
  Bottom 1.778: 53.66,74.41 JP401.2 JP402.2 JP403.2 | JP203.2 21.91,74.41 | JP303.2 38.42,74.41
  Bottom 2.184: JP203.2 JP202.2 JP201.2 | JP301.2 JP302.2 JP303.2 | 33.02,78.11 21.91,78.11 21.91,74.41 | 38.42,74.41 38.42,78.11
  Bottom 2.54: 90.28,75.68 87.95,71.44 66.36,71.44 JP501.2 JP502.1 53.66,86.36 53.66,78.11 | 53.66,74.41 53.66,78.11 | 53.66,78.11 38.42,78.11 33.02,78.11 | IC1.1 90.49,75.67
  other vias: 63.18,87 63.18,85.72 64.45,85.72 64.45,87
BUTTON
  Top 0.305: JP34.2 U1.#19
  Top 0.813: U1.#19 U1.19 U1.@19
BUTTON_LED
  Top 0.406: U1.#20 28.89,5.08 35.94,5.08 R1.1
  Top 0.813: U1.@20 U1.20 U1.#20
CHANNEL1
  Top 0.305: R201.2 17.57,43.92 19.48,42.02 21.39,42.02 21.39,31.99
  Top 0.61: 21.39,31.99 U1.@8
  Top 0.813: U1.@8 U1.8 U1.#8
CHANNEL2
  Top 0.305: 23.81,33.02 23.81,41.91 27.3,41.91 27.3,43.81 29.53,46.35 R301.1
  Top 0.61: U1.@7 23.81,33.02
  Top 0.813: U1.#7 U1.7 U1.@7
CHANNEL3
  Top 0.305: U1.@4 31.42,42.53 32.5,43.29 47.27,43.29 R401.1
  Top 0.813: U1.@4 U1.4 U1.#4
CHANNEL4
  Top 0.305: U1.@3 33.96,39.99 34.72,41.07 57.58,41.07 61.39,43.61 61.39,56.36 61.59,56.52 R501.1
  Top 0.813: U1.#3 U1.3 U1.@3
CHANNEL_1_SWITCHED
  Top 0.61: D1.C 22.95,51.2 23.93,52.18
  Top 1.27: 24.56,54.72 23.93,52.18 Q2.4
  Top 1.93: 23.29,55.99 25.83,54.72 24.56,54.72 | 24.56,54.72 JP201.1 JP202.1 JP203.1 | 24.56,54.72 22.97,54.72 Q2.4
  pour Top (isolate 0.406, no thermals): 21.39,53.45 21.39,76.31 27.1,76.31 27.1,54.72 25.83,53.45
CHANNEL_2_SWITCHED
  Top 0.61: D2.C 37.23,51.2 37.47,51.44 37.47,52.07 Q3.4
  Top 1.93: 38.53,55.99 41.07,54.72 40.12,54.72 Q3.4 38.21,54.72 41.07,55.99 JP301.1 JP302.1 JP303.1
  pour Top (isolate 0.406, no thermals): 36.62,53.45 36.62,77.58 42.34,77.58 42.34,54.72 41.07,53.45
CHANNEL_3_SWITCHED
  Top 0.61: D3.C 53.74,51.2 54.61,52.07 54.61,53.56 Q4.4
  Top 1.93: JP401.1 56.31,55.35 Q4.4
  pour Top (isolate 0.406, no thermals): 51.87,75.99 57.58,75.99 57.58,50.91 52.5,50.91 52.5,55.99 51.87,55.99
CHANNEL_4_SWITCHED  (via drill 0.6)
  Top 0.406: D4.C 64.54,65.17 Q5.4
  Top 1.93: JP502.2 69.96,84.25 69.96,75.36 JP501.1 69.01,68.06 Q5.4
  other vias: 66.04,68.58 67.31,68.58 68.58,68.58
  pour Top (isolate 0.406, no thermals): 68.38,87.42 74.09,87.42 74.09,64.88 65.2,64.88 65.2,69.96 67.74,69.96 68.38,71.23
  pour Bottom: 63.5,62.23 69.53,62.23 69.53,68.9 63.5,68.9
D3
  Top 0.813: U1.@16 U1.16 U1.#16
DAC
  Top 0.813: U1.@6 U1.6 U1.#6
GND  (via drill 0.6)  (1 unrouted)
  Top 0.305: D7.C 36.83,82.55 | IC2.6 76.52,40.01
  Top 0.406: U4.2 U4.1
  Top 0.61: R202.2 25.2,43.92 | 25.83,46.49 Q2.3
  other vias: 43.29,50.27 28.05,50.27 43.29,49.01 71.55,62.34 71.55,61.07 71.55,59.8 58.85,48.37 58.85,47.1 58.85,45.83 28.05,49.01 61.59,76.83 61.59,75.56 32.7,39.05 72.82,62.34 72.82,61.07 72.82,59.8 10.79,53.98 56.52,82.23 12.06,83.19 14.61,83.19 26.15,47.73 41.39,47.73 69.33,59.8 56.63,47.73 64.14,37.47 40.64,23.5 28.05,51.55 28.05,52.81 43.29,51.55 43.29,52.81 58.85,49.64 26.15,46.47 41.39,46.47 56.63,46.47 58.85,44.56 57.58,44.56 44.56,52.81 44.56,51.55 44.56,50.27 44.56,49.01 29.32,52.81 29.32,51.55 29.32,50.27 29.32,49.01 12.06,84.45 13.34,83.19 60.33,75.56 60.33,76.83
  pour Bottom (isolate 0.406, rank 6): -1.92,91.55 102.03,91.55 101.39,-1.16 101.39,-1.08 -1.92,-1.35
  pour Top (isolate 0.406, rank 4): -3.81,91.44 105.41,91.44 105.41,-2.54 -3.81,-2.54
LIGHT_LEVEL
  Top 0.305: U1.@11 13.64,46.35 JP48.2
  Top 0.813: U1.#11 U1.11 U1.@11
N$1
  Top 0.305: D7.A 39.69,87.54
  Top 0.406: 39.69,87.54 R5.1
N$2
  Top 0.305: 21.5,46.73 R201.1 | 22.02,46.49 22.02,44.93 R202.1
  Top 0.406: Q2.1 21.5,46.73
  Top 0.61: 22.02,46.49 Q2.1
N$3
  Top 0.305: R302.1 R301.2 36.83,46.35
  Top 0.61: 36.74,46.73 Q3.1 | 37.26,47.1 36.62,46.61 Q3.1 | 36.83,46.35 Q3.1
N$4
  Top 0.406: Q4.1 52.06,46.87 52.06,43.33 | R401.2 52.06,43.33 | 52.06,43.33 52.06,43.31 53.51,43.31 R402.1
N$5
  Top 0.305: 39.69,85.41 43.18,85.41 43.18,86.07 | U4.8 54.29,81.6 54.29,86.02 R14.1
  Top 0.406: 39.69,85.41 R5.2
  Top 2.54: R14.1 43.18,86.07 43.18,86.36 48.26,86.36 F1.2A
N$6
  Top 0.406: U3.4 78.38,50.8 R2.1
N$7
  Top 0.305: Q5.1 64.83,58.64 R502.1 | 64.69,60.7 64.69,59.05 | 64.69,59.05 64.69,58.65 | R501.2 62.23,59.05 64.69,59.05
  Top 0.406: 64.69,60.7 Q5.1
N$8
  Top 0.305: R2.2 80.39,74.04 JP35.2
N$9
  Bottom 0.61: D9.A 88.95,54.82 R20.2
N$11
  Top 0.406: F1.1A 27.94,86.68
  Top 2.54: F1.1A 32.7,86.04 | 28.26,86.68 27.94,86.68 JP1.1
N$12
  Top 0.406: 34.09,2.65 33.66,2.54 JP34.3
  Top 0.813: R1.2 34.09,2.65
N$22
  Top 0.406: D6.A 90.17,67.31 R13.1
N$23
  Top 0.61: R10.1 D5.A
N$24
  Top 0.61: D4.A R9.2
N$25
  Top 0.61: D3.A 49.12,54.2 48.9,54.61 R8.2
N$26
  Top 0.61: JP47.2 R11.2
N$27
  Top 0.61: D2.A R7.2
N$32
  Top 0.61: D1.A R6.2
NEOPIXELS  (via drill 0.6)
  Top 0.305: v44.45,40.01 57.78,40.01 62.02,42.97 62.02,51.23 62.55,51.75 U3.2 | v44.45,30.48 44.45,17.14 24.45,17.14 23.81,16.51 23.81,14.1 U1.@18
  Top 0.813: U1.@18 U1.18 U1.#18
  Bottom 0.305: v44.45,40.01 v44.45,30.48
PIR
  Top 0.61: R11.1 11.11,35.56 | 11.11,35.56 11.11,38.42 R12.1 | 11.11,31.86 11.11,35.56
  Top 0.813: U1.#12 U1.12 U1.@12 11.11,31.86
RST
  Top 0.813: U1.@23 U1.23 U1.#23
SCL
  Top 0.305: JP2.3 1.91,76.2 1.91,11.11 9.53,11.11 9.53,15.56 13.64,15.56 U1.#14 | U4.4 10.48,77.79 10.48,76.2 R16.2
  Top 0.406: 10.48,76.2 JP2.3
  Top 0.813: U1.@14 U1.14 U1.#14
SDA
  Top 0.305: U1.@13 11.11,14.08 11.11,10.16 1.27,10.16 1.27,78.74 JP2.4 | 6.35,78.74 7.62,78.74 7.62,79.06 15.24,79.06 | 15.24,79.06 U4.3 | R19.2 15.24,79.06
  Top 0.406: JP2.4 6.35,78.74
  Top 0.813: U1.#13 U1.13 U1.@13
TEMPERATURE
  Top 0.305: U1.@10 14.61,33.77 14.61,48.9 13.97,48.9 U2.DQ | R15.2 8.89,53.34
  Top 0.406: 8.89,60.33 JP49.2 7.62,60.33 | 8.89,60.33 13.97,60.33 U2.DQ | 8.89,53.34 8.89,60.33
  Top 0.813: U1.@10 U1.10 U1.#10
USB_VA
  Top 0.61: IC2.8 76.83,42.55
  Top 1.27: 76.83,42.55 88.41,42.55 X2.1
USB_VB
  Top 0.61: IC2.5 76.52,38.73
  Top 1.27: 76.52,38.73 83.82,38.73 83.82,40.46 D8.A
USB_VENABLE_A  (via drill 0.6)
  Top 0.305: IC2.1 63.18,42.55 62.23,41.91 58.1,39.05 v43.18,39.05 | v43.18,30.48 43.18,18.1 22.86,18.1 21.27,16.51 U1.@17
  Top 0.61: R3.1 U1.#17
  Top 0.813: U1.@17 U1.17 U1.#17
  Bottom 0.305: v43.18,39.05 v43.18,30.48
USB_VENABLE_B  (via drill 0.6)
  Top 0.305: IC2.4 59.69,38.73 58.74,38.1 v41.91,38.1 | v41.91,30.48 41.91,19.05 17.46,19.05 16.19,17.46 U1.@15
  Top 0.61: R4.1 U1.#15
  Top 0.813: U1.#15 U1.15 U1.@15
  Bottom 0.305: v41.91,38.1 v41.91,30.48
VBAT
  Top 0.813: U1.#22 U1.22 U1.@22
VIN  (via drill 0.6)
  Top 0.305: R10.2 80.28,89.17 80.01,88.9 80.01,87.31 JP36.1
  Top 0.406: U3.5 75.56,52.7 77.47,54.61 77.47,59.02 C4.+
  Top 1.016: 77.9,74.28 JP35.3 | 77.99,60.89 C4.+
  Top 1.27: v78.11,46.99 84.14,46.99 D8.C
  Top 1.676: JP35.3 77.99,60.89
  Top 1.778: JP36.1 77.99,86.36 JP35.3
  Bottom 1.27: v78.11,46.99 78.03,48.26 C4.+
VIN_MONITOR
  Top 0.406: U1.#9 18.72,23.18 R17.1 R18.2
  Top 0.813: U1.@9 U1.9 U1.#9
WKP
  Top 0.813: U1.#5 U1.5 U1.@5

### Text on the board
tNames: + | VIn | 5A Max | 12V DC | SDA | + | 4 | + | + | 1 | + | 2 | + | 3 | SCL | 12V | + | GND | 3v3 | GND | NeoPixels | 5V | 5V | D | GND | Temperature Sensor | GND | +12V | 5V | GND | DQ | 3v3 | DS18B20 | USB A | Light Sensor | GND | S | 3v3 | GND | PIR (5V) | +5V | +5V | S | PIR | Light Sensor | Temperature (1-Wire) | VIn Monitor | Channel 1 | Channel 2 | DAC | WKP | Channel 3 | Channel 4 | GND | 5V | 3v3 | 3v3 | +5V | A1 | A2 | A3 | A4 | A5 | Rx | Tx | IoT Low Voltage Lights Controller | (c) Tinamous.com - S.Harrison - 03 April 2016 | Github.com/Tinamous/KitchenLightsController | D1 | D2 | D3 | D4 | Neo | D6 | D7 | GND | VB | RST | GND | D3 | GND | B | LED | 3v3 | GND | Button | V2.04 | USB B | USB A